# EAGLE design myhalf (EAGLE 6.4)
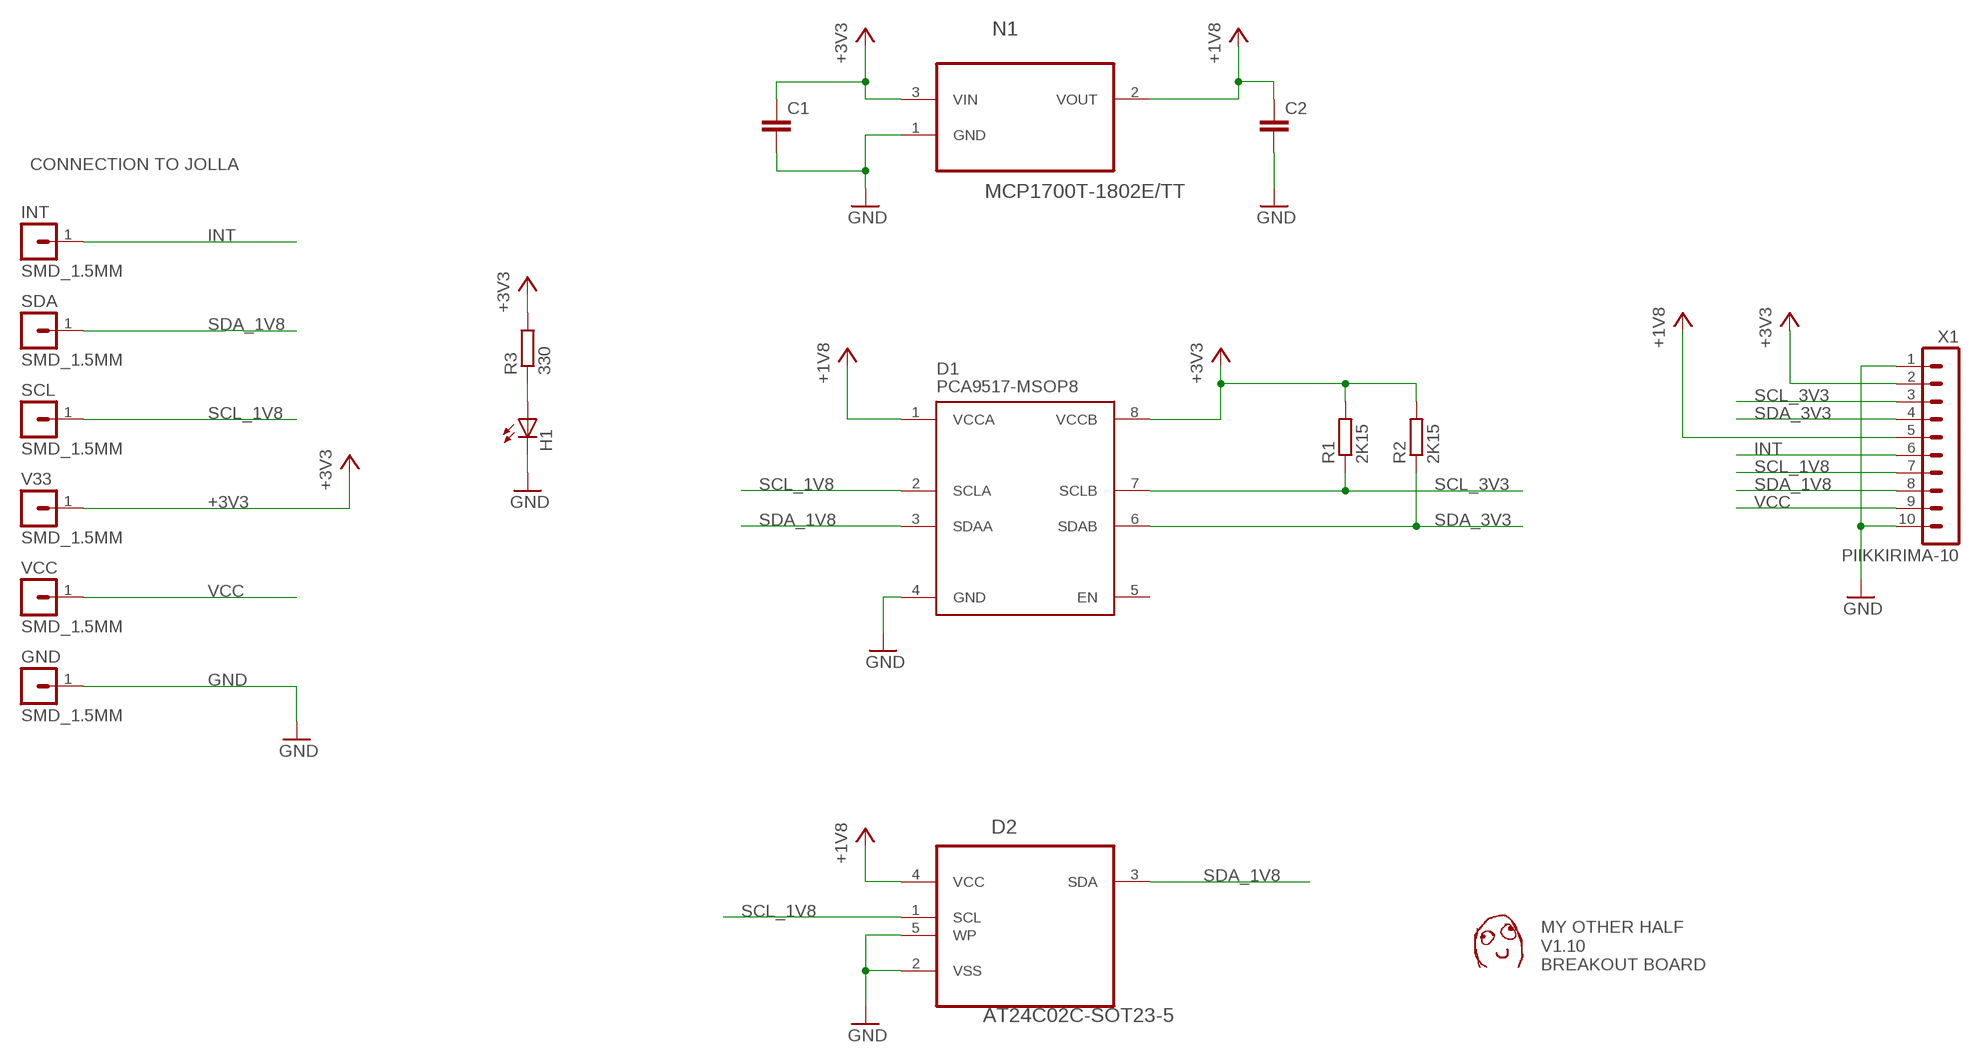
[diagram p0: schematic, sheet 1]

## Parts
C1  C-EUC0603  [C0603]
C2  C-EUC0603  [C0603]
D1  PCA9517-MSOP8  PCA9517  [SOP65P490X110-8N]
D2  AT24C02C-SOT23-5  24LC01BT-I/OT  [SOT95P280X145-5N]
GND  SMD_1.5MM  [SMD_ROUND_1.5MM]
H1  LEDCHIP-LED0603  [CHIP-LED0603]
INT  SMD_1.5MM  [SMD_ROUND_1.5MM]
N1  MCP1700T-1802E/TT  [SOT95P237X112-3N]
R1  2K15  R-EU_R0603  [R0603]
R2  2K15  R-EU_R0603  [R0603]
R3  330  R-EU_R0603  [R0603]
SCL  SMD_1.5MM  [SMD_ROUND_1.5MM]
SDA  SMD_1.5MM  [SMD_ROUND_1.5MM]
U$1  DAFUG  [DAFUG]
V33  SMD_1.5MM  [SMD_ROUND_1.5MM]
VCC  SMD_1.5MM  [SMD_ROUND_1.5MM]
X1  PIIKKIRIMA-10  [PIIKKIRIMA-10]

## Nets
+1V8: C2.1 D1.1(VCCA) D2.4(VCC) N1.2(VOUT) X1.5
+3V3: C1.1 D1.8(VCCB) N1.3(VIN) R1.2 R2.2 R3.2 V33.1 X1.2
GND: C1.2 C2.2 D1.4(GND) D2.2(VSS) D2.5(WP) GND.1 H1.C N1.1(GND) X1.1 X1.10
INT: INT.1 X1.6
N$2: H1.A R3.1
SCL_1V8: D1.2(SCLA) D2.1(SCL) SCL.1 X1.7
SCL_3V3: D1.7(SCLB) R1.1 X1.3
SDA_1V8: D1.3(SDAA) D2.3(SDA) SDA.1 X1.8
SDA_3V3: D1.6(SDAB) R2.1 X1.4
VCC: VCC.1 X1.9
Unconnected: D1.5(EN)

## Notes on the sheet
- CONNECTION TO JOLLA
- MY OTHER HALF
  V1.10
  BREAKOUT BOARD

## Library data of the parts
C1 C2 = rcl:C-EU: CAPACITOR, European symbol
D1 = OMAT_IC:PCA9517
D2 = Microchip_By_element14_Batch_1:24LC01BT-I/OT: Serial EEPROM; MPN: 24LC01BT-I/OT; OC_FARNELL: 9757880; OC_NEWARK: 12C1993; PACKAGE: SOT23-5; SUPPLIER: MICROCHIP
GND INT SCL SDA V33 VCC = OMAT_IC:SMD_1.5MM
H1 = OMAT_IC:LED: LED OSRAM: - CHIPLED LG R971, LG N971, LY N971, LG Q971, LY Q971, LO R971, LY R971 LH N974, LH R974 LS Q976, LO Q976, LY Q976 LO Q996 - Hyper CHIPLED LW Q18S LB Q993, LB Q99A, LB R99A - SideLED LS A670, LO A670, LY A670, LG A670, LP A670 LB A673, LV A673, LT A673, LW A673 LH A674 LY A675 LS A676, LA A676, LO A676, LY A676, LW A676 LS A679, LY A679, LG A679 - Hyper Micro SIDELED® LS Y876, LA Y876, LO Y876, LY Y876 LT Y87S - SmartLED LW L88C, LW L88S LB L89C, LB L89S, LG L890 LS L89K, LO L89K, LY L89K LS L896, LA L896, LO L896, LY L896 - TOPLED LS T670, LO T670, LY T670, LG T670, LP T670 LSG T670, LSP T670, LSY T670, LOP T670, LYG T670 LG T671, LOG T671, LSG T671 LB T673, LV T673, LT T673, LW T673 LH T674 LS T676, LA T676, LO T676, LY T676, LB T676, LH T676, LSB T676, LW T676 LB T67C, LV T67C, LT T67C, LS T67K, LO T67K, LY T67K, LW E67C LS E67B, LA E67B, LO E67B, LY E67B, LB E67C, LV E67C, LT E67C LW T67C LS T679, LY T679, LG T679 LS T770, LO T770, LY T770, LG T770, LP T770 LB T773, LV T773, LT T773, LW T773 LH T774 LS E675, LA E675, LY E675, LS T675 LS T776, LA T776, LO T776, LY T776, LB T776 LHGB T686 LT T68C, LB T68C - Hyper Mini TOPLED® LB M676 - Mini TOPLED Santana® LG M470 LS M47K, LO M47K, LY M47K Source: http://www.osram.convergy.de LUXEON: - LUMILED® LXK2-PW12-R00, LXK2-PW12-S00, LXK2-PW14-U00, LXK2-PW14-V00 LXK2-PM12-R00, LXK2-PM12-S00, LXK2-PM14-U00 LXK2-PE12-Q00, LXK2-PE12-R00, LXK2-PE12-S00, LXK2-PE14-T00, LXK2-PE14-U00 LXK2-PB12-K00, LXK2-PB12-L00, LXK2-PB12-M00, LXK2-PB14-N00, LXK2-PB14-P00, LXK2-PB14-Q00 LXK2-PR12-L00, LXK2-PR12-M00, LXK2-PR14-Q00, LXK2-PR14-R00 LXK2-PD12-Q00, LXK2-PD12-R00, LXK2-PD12-S00 LXK2-PH12-R00, LXK2-PH12-S00 LXK2-PL12-P00, LXK2-PL12-Q00, LXK2-PL12-R00 Source: www.luxeon.com KINGBRIGHT: KA-3528ASYC Source: www.kingbright.com
N1 = Microchip_By_element14_Batch_1:MCP1700T-1802E/TT: Low Quiescent Current LDO; MPN: MCP1700T-1802E/TT; OC_FARNELL: 1296591; OC_NEWARK: 84R5175; PACKAGE: SOT23-3; SUPPLIER: Microchip
R1-R3 = rcl:R-EU_: RESISTOR, European symbol
U$1 = dafug:DAFUG
X1 = OMAT_IC:PIIKKIRIMA-10

## Board
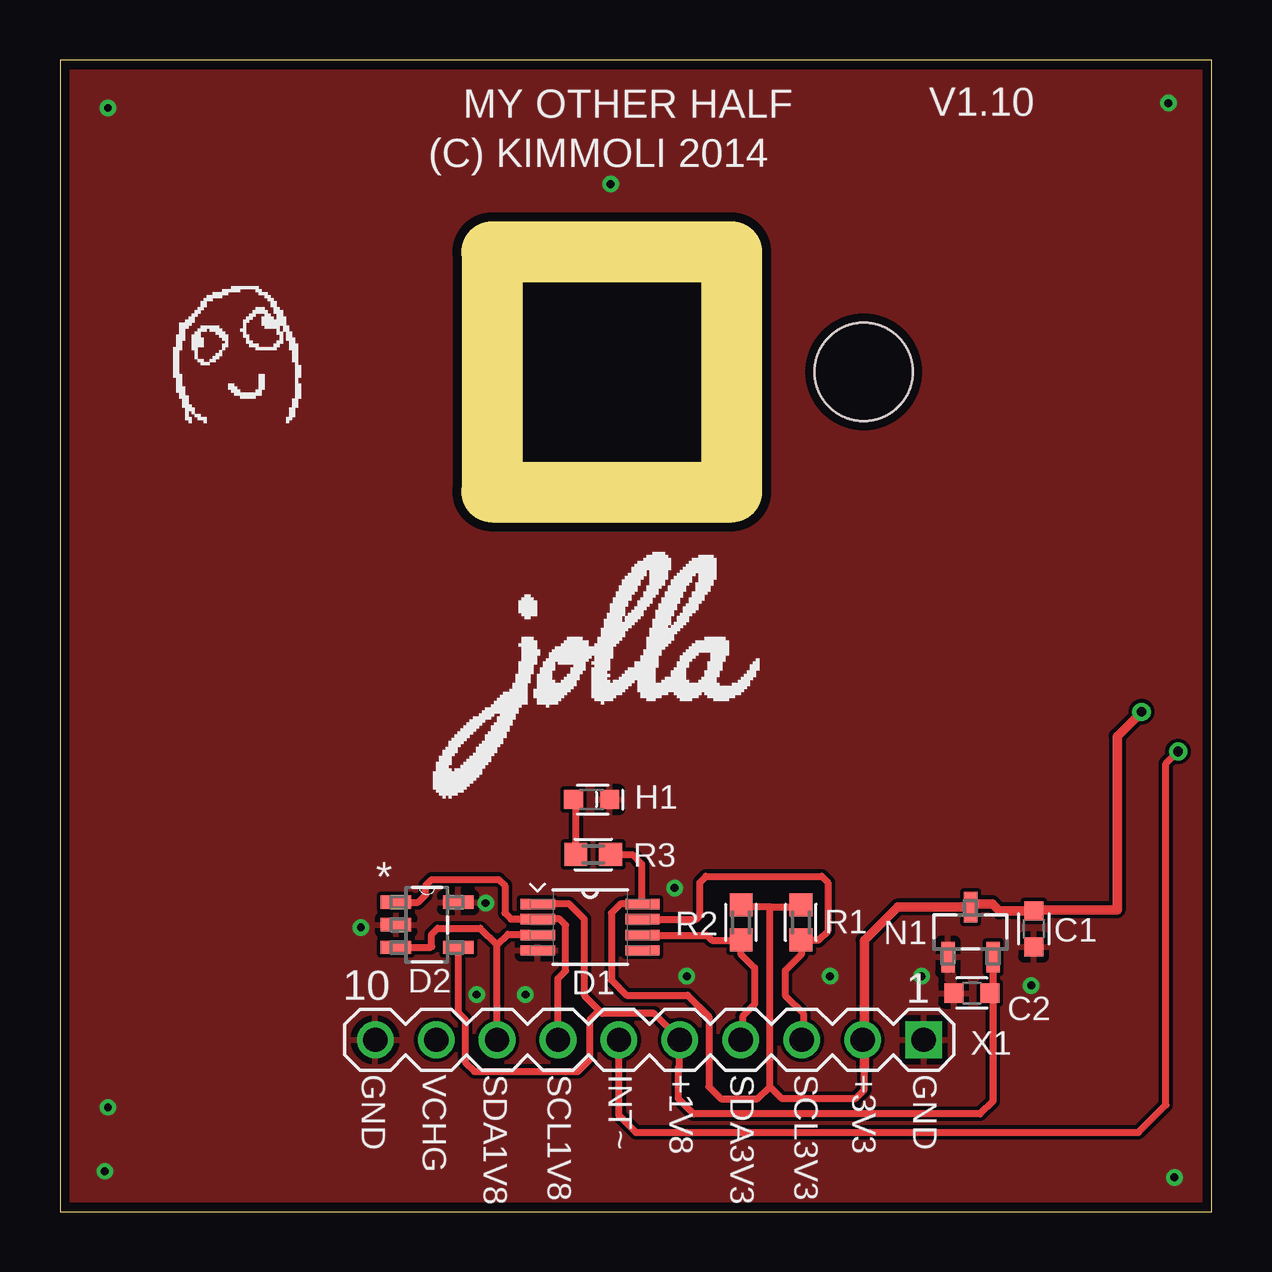
[diagram p1: board, top side]
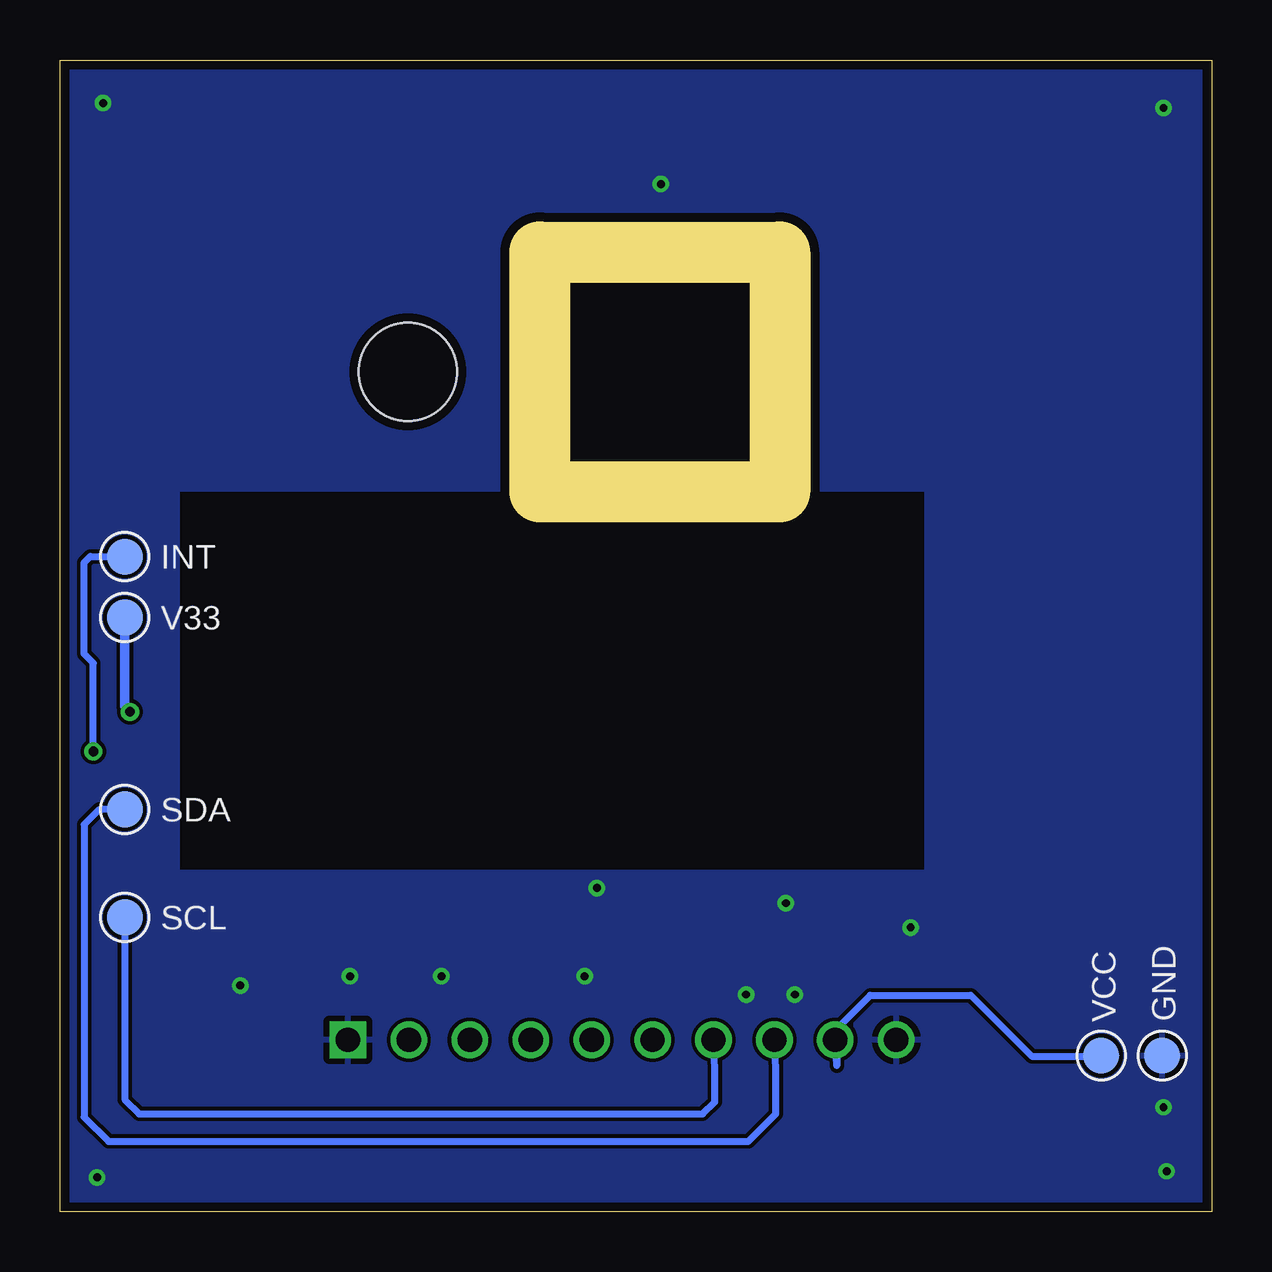
[diagram p2: board, bottom side, seen from below]

Size 48 x 48 mm. Coordinates in mm from the lower left corner, seen from the top.
Outline: 0,0 48,0 48,48 0,48 0,0
Outline: 18,30 28,30 28,40 18,40 18,30
Copper layers (1*16): Top 0.0356mm / dielectric 1.5011mm / Bottom 0.0356mm
Design rules "LaenPCBOrder": minimum track width 6mil, minimum drill 13mil, track to track 6mil, track to pad 6mil, pad to pad 6mil, via to via 6mil, smd to smd 6mil, copper to edge 15mil, drill to drill 6mil, minimum pad ring 7mil, minimum via ring 7mil, stop-mask expansion 4mil, vias tented up to drill 0mil, thermal gap 10mil
Holes 4.1 mm at 33.5,35

### Footprints (pad centres in the part's own frame; a part is rotated, then mirrored left to right if it is on the bottom)
C0603 = smd 0.8 x 0.8: 1 -0.75,0; 2 0.75,0
SOP65P490X110-8N = smd 1.422 x 0.432: 1 -2.184,0.965; 2 -2.184,0.33; 3 -2.184,-0.33; 4 -2.184,-0.965; 5 2.184,-0.965; 6 2.184,-0.33; 7 2.184,0.33; 8 2.184,0.965
SOT95P280X145-5N = smd 1.27 x 0.559: 1 -1.295,0.94; 2 -1.295,0; 3 -1.295,-0.94; 4 1.295,-0.94; 5 1.295,0.94
SMD_ROUND_1.5MM = smd 1.5 x 1.5: 1 0,0
CHIP-LED0603 = smd 0.8 x 0.8: A -0.75,0; C 0.75,0
SOT95P237X112-3N = smd 0.559 x 1.27: 1 -0.94,-1.041; 2 0.94,-1.041; 3 0,1.041
R0603 = smd 0.95 x 0.95: 1 -0.725,0; 2 0.725,0
PIIKKIRIMA-10 = drill 1.016 square: 1 0,0 | drill 1.016: 2 2.54,0; 3 5.08,0; 4 7.62,0; 5 10.16,0; 6 12.7,0; 7 15.24,0; 8 17.78,0; 9 20.32,0; 10 22.86,0

### Placement (x,y rotation side)
C1  40.59,11.78 270 top
C2  38.01,9.1 180 top
D1  22.1,11.85 0 top
D2  15.3,11.95 0 top
GND  2.06,6.5 0 bottom
H1  22.16,17.17 0 top
INT  45.3,27.3 0 bottom
N1  37.95,11.65 0 top
R1  30.88,12.05 90 top
R2  28.39,12.05 90 top
R3  22.23,14.88 0 top
SCL  45.3,12.26 0 bottom
SDA  45.3,16.76 0 bottom
U$1  7.58,35.47 0 top
U$2  [JOLLALOGO]  22.99,22.23 0 top
V33  45.3,24.76 0 bottom
VCC  4.6,6.5 0 bottom
X1  36,7.16 180 top

### Tracks (layer width: path | path; a pad name or v marks a point on that pad's centre or on a via)
+1V8
  Top 0.3: N1.2 38.89,9.14 | 38.89,9.14 38.89,4.6 38.35,4.06 26.42,4.06 25.78,4.7 25.78,5.99 25.82,5.99 X1.5 25.84,7.18 24.77,8.26 22.61,8.26 22.48,8.38 | D1.1 21.21,12.83 21.84,12.19 21.84,9.02 22.48,8.38 | C2.1 38.85,9.1 38.89,9.14 | D2.4 16.59,8.3 16.89,8 16.89,6.22 17.27,5.84 21.59,5.84 22.1,6.35 22.1,8 22.48,8.38
+3V3  (via drill 0.4)
  Top 0.3: R3.2 22.97,14.86 23.88,14.86 24.26,14.48 24.26,12.95 24.28,12.93 D1.8 23.36,12.82 22.99,12.45 22.99,9.65 23.62,9.02 26.16,9.02 27.05,8.13 27.05,5.21 27.56,4.7 29.08,4.7 29.59,5.21 | 38.09,12.83 N1.3 | 40.63,12.57 C1.1 | 29.59,5.21 30.1,4.7 33.15,4.7 33.53,5.08 33.53,5.95 X1.2 | 29.59,5.21 29.59,12.7 | 29.59,12.7 28.47,12.7 R2.2 | 29.59,12.7 30.81,12.7 R1.2
  Top 0.4: v45.09,20.83 44.07,19.81 44.07,12.57 40.63,12.57 | 38.09,12.83 38.86,12.83 39.16,12.53 C1.1 | N1.3 34.92,12.69 33.53,11.3 33.53,5.95
  Bottom 0.4: V33.1 45.3,21.04 v45.09,20.83
GND  (via drill 0.33)
  other vias: 46.2,46.2 2,46 1.87,1.68 46.45,1.42 40.48,9.42 19.4,9.04 12.54,11.84 35.91,9.8 26.13,9.8 17.75,12.85 17.37,9.04 22.95,42.83 2,4.34 25.62,13.49 32.1,9.8
  pour Bottom: 0,48 48,48 48,0 0,0
  pour Top: 0,48 48,48 48,0 0,0
INT  (via drill 0.4)
  Top 0.3: v46.61,19.18 46.1,18.67 46.1,4.45 44.96,3.3 24,3.3 23.3,4 X1.6
  Bottom 0.3: INT.1 46.74,27.3 46.99,27.05 46.99,23.24 46.61,22.86 v46.61,19.18
N$1
  cutout Bottom (rank 2): 43,14.27 43,30 12,30 12,14.27
N$2
  Top 0.3: R3.1 21.5,17.07 H1.A
SCL_1V8
  Top 0.3: D2.1 14.92,12.89 15.24,13.21 15.24,13.59 15.49,13.84 18.29,13.84 18.54,13.59 18.54,12.45 18.8,12.19 19.91,12.19 D1.2 19.93,12.19 20.83,12.19 21.08,11.94 21.08,10.03 20.76,9.71 X1.7
  Bottom 0.3: SCL.1 45.3,4.66 44.7,4.06 21.21,4.06 20.7,4.57 20.7,5.96 X1.7
SCL_3V3
  Top 0.3: D1.7 26.53,12.18 26.67,12.32 26.67,13.72 26.92,13.97 31.75,13.97 32,13.72 32,11.68 31.62,11.3 30.91,11.3 | 30.91,11.3 R1.1 | 30.91,11.3 30.91,10.71 30.23,10.03 30.23,9.02 30.99,8.26 30.99,7.22 X1.3
SDA_1V8
  Top 0.3: X1.8 18.22,11.11 | 18.22,11.11 18.67,11.56 19.88,11.56 D1.3 | D2.3 15.46,11.01 15.49,11.05 15.49,11.56 15.75,11.81 17.52,11.81 18.22,11.11
  Bottom 0.3: SDA.1 46.36,16.76 46.99,16.13 46.99,3.94 45.97,2.92 19.3,2.92 18.16,4.06 18.16,5.96 X1.8
SDA_3V3
  Top 0.3: D1.6 26.96,11.52 27.18,11.3 28.37,11.3 | 28.37,11.3 R2.1 | 28.37,11.3 28.37,10.75 28.96,10.16 28.96,8.64 28.45,8.13 28.45,7.22 X1.4
VCC
  Bottom 0.3: X1.9 15.62,6.07 15.62,7.62 14.22,9.02 10.03,9.02 7.49,6.48 4.62,6.48 VCC.1

### Text on the board
tPlace: MY OTHER HALF | V1.10 | (C) KIMMOLI 2014 | GND | VCHG | SDA1V8 | SCL1V8 | INT~ | +1V8 | SDA3V3 | SCL3V3 | +3V3 | GND